# Altium schematic sheet MainSheet.SchDoc
size A4; Organization: OLTEST; Revision: 01; SheetNumber: 0; SheetTotal: 13; Название листа: Название листа; Разработчик: Бондарчук С.; Прибор: R100; АМАК.000000.000 Э3: R100.230.030.000-00; Дата: 16.04.2019; Формат: A4; WorkspaceName: R100_Board_v1
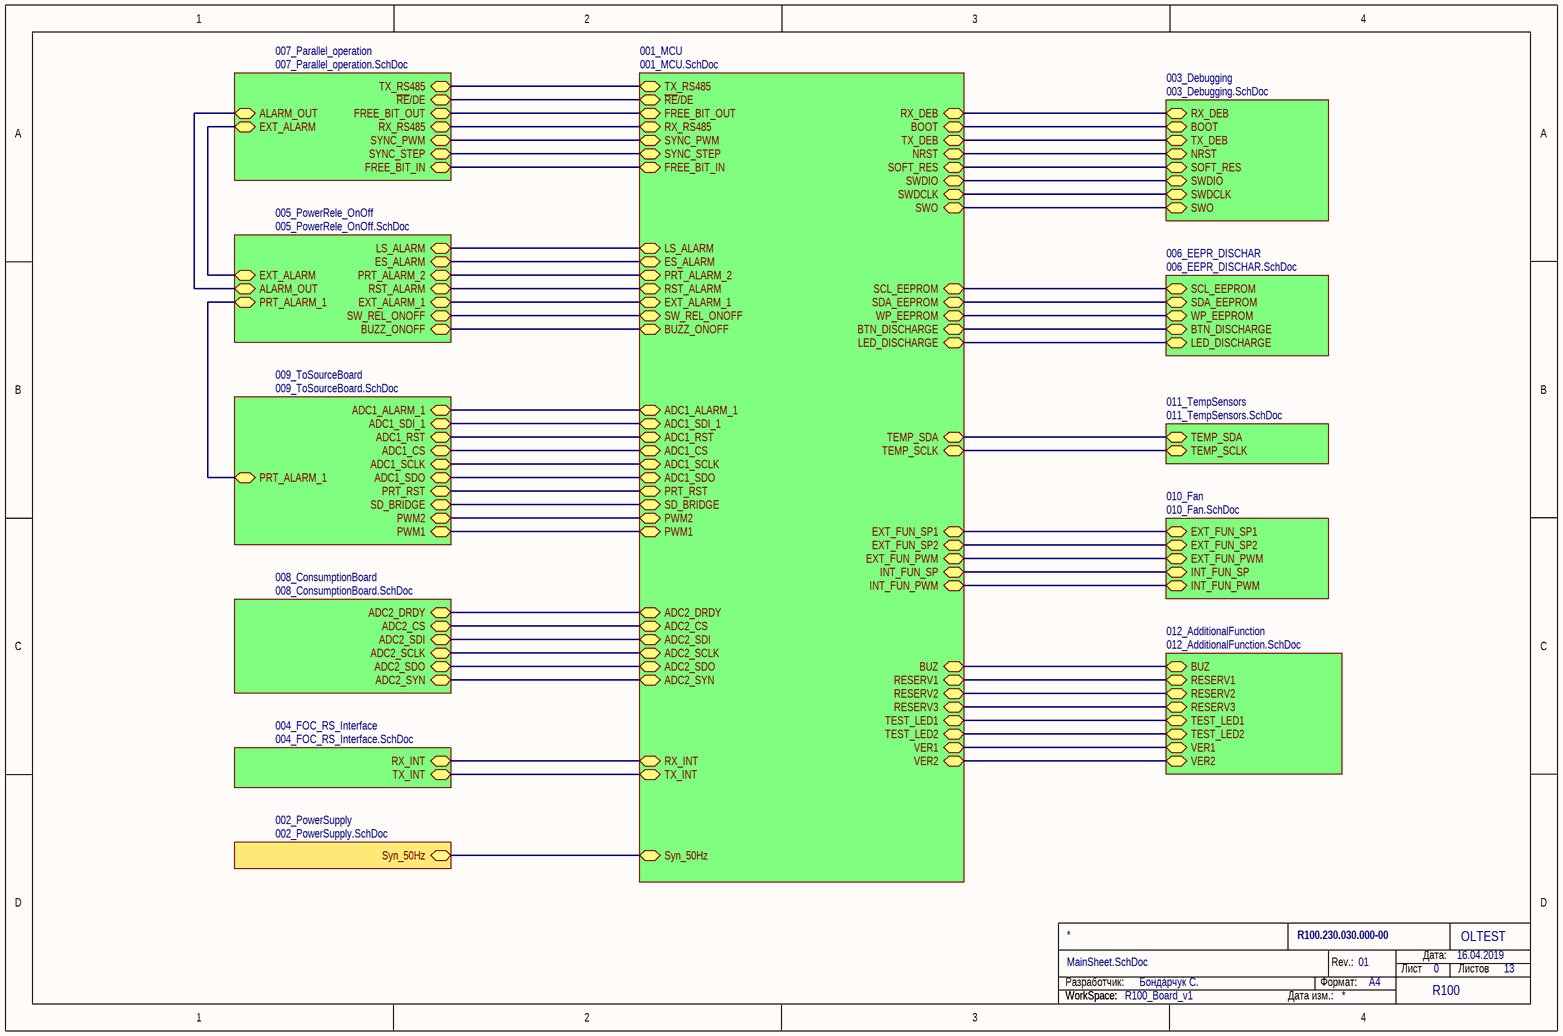
[diagram p0: MainSheet.SchDoc]

## Sub-sheets
001_MCU = 001_MCU.SchDoc: SWO, SOFT_RES, TX_INT, PRT_ALARM_2, WP_EEPROM, SWDCLK, TX_RS485, LS_ALARM, SCL_EEPROM, SW_REL_ONOFF, ES_ALARM, NRST, RST_ALARM, RX_INT, RX_DEB, Syn_50Hz, BOOT, SDA_EEPROM, SWDIO, TX_DEB, SYNC_PWM, INT_FUN_SP, ADC1_SDI_1, TEMP_SDA, VER2, LED_DISCHARGE, RX_RS485, ADC1_SDO, ADC2_SDI, EXT_FUN_SP2, ADC1_ALARM_1, FREE_BIT_IN, VER1, ADC2_CS, TEST_LED2, BUZ, ADC1_RST, ADC2_SYN, SD_BRIDGE, ADC1_SCLK, TEST_LED1, PWM1, BUZZ_ONOFF, ADC2_SCLK, EXT_FUN_SP1, ADC1_CS, BTN_DISCHARGE, RESERV2, EXT_ALARM_1, PWM2, ADC2_SDO, RESERV1, EXT_FUN_PWM, TEMP_SCLK, PRT_RST, RESERV3, FREE_BIT_OUT, ~{RE}/DE, INT_FUN_PWM, ADC2_DRDY, SYNC_STEP
002_PowerSupply = 002_PowerSupply.SchDoc: Syn_50Hz
003_Debugging = 003_Debugging.SchDoc: SWDIO, TX_DEB, RX_DEB, SWO, SWDCLK, BOOT, SOFT_RES, NRST
004_FOC_RS_Interface = 004_FOC_RS_Interface.SchDoc: RX_INT, TX_INT
005_PowerRele_OnOff = 005_PowerRele_OnOff.SchDoc: PRT_ALARM_1, LS_ALARM, ES_ALARM, PRT_ALARM_2, RST_ALARM, SW_REL_ONOFF, EXT_ALARM, ALARM_OUT, BUZZ_ONOFF, EXT_ALARM_1
006_EEPR_DISCHAR = 006_EEPR_DISCHAR.SchDoc: SCL_EEPROM, SDA_EEPROM, WP_EEPROM, BTN_DISCHARGE, LED_DISCHARGE
007_Parallel_operation = 007_Parallel_operation.SchDoc: ~{RE}/DE, FREE_BIT_OUT, TX_RS485, ALARM_OUT, RX_RS485, SYNC_PWM, SYNC_STEP, EXT_ALARM, FREE_BIT_IN
008_ConsumptionBoard = 008_ConsumptionBoard.SchDoc: ADC2_CS, ADC2_SDI, ADC2_DRDY, ADC2_SCLK, ADC2_SDO, ADC2_SYN
009_ToSourceBoard = 009_ToSourceBoard.SchDoc: SD_BRIDGE, ADC1_RST, ADC1_ALARM_1, PRT_RST, ADC1_SDI_1, PRT_ALARM_1, ADC1_SCLK, ADC1_CS, ADC1_SDO, PWM2, PWM1
010_Fan = 010_Fan.SchDoc: EXT_FUN_PWM, EXT_FUN_SP1, EXT_FUN_SP2, INT_FUN_SP, INT_FUN_PWM
011_TempSensors = 011_TempSensors.SchDoc: TEMP_SCLK, TEMP_SDA
012_AdditionalFunction = 012_AdditionalFunction.SchDoc: RESERV3, RESERV2, VER2, BUZ, RESERV1, VER1, TEST_LED1, TEST_LED2

## Nets
(unnamed): sheet 001_MCU/SWO, sheet 003_Debugging/SWO
(unnamed): sheet 001_MCU/SOFT_RES, sheet 003_Debugging/SOFT_RES
(unnamed): sheet 001_MCU/TX_INT, sheet 004_FOC_RS_Interface/TX_INT
(unnamed): sheet 001_MCU/PRT_ALARM_2, sheet 005_PowerRele_OnOff/PRT_ALARM_2
(unnamed): sheet 001_MCU/WP_EEPROM, sheet 006_EEPR_DISCHAR/WP_EEPROM
(unnamed): sheet 001_MCU/SWDCLK, sheet 003_Debugging/SWDCLK
(unnamed): sheet 001_MCU/TX_RS485, sheet 007_Parallel_operation/TX_RS485
(unnamed): sheet 001_MCU/LS_ALARM, sheet 005_PowerRele_OnOff/LS_ALARM
(unnamed): sheet 001_MCU/SCL_EEPROM, sheet 006_EEPR_DISCHAR/SCL_EEPROM
(unnamed): sheet 001_MCU/SW_REL_ONOFF, sheet 005_PowerRele_OnOff/SW_REL_ONOFF
(unnamed): sheet 001_MCU/ES_ALARM, sheet 005_PowerRele_OnOff/ES_ALARM
(unnamed): sheet 001_MCU/NRST, sheet 003_Debugging/NRST
(unnamed): sheet 001_MCU/RST_ALARM, sheet 005_PowerRele_OnOff/RST_ALARM
(unnamed): sheet 001_MCU/RX_INT, sheet 004_FOC_RS_Interface/RX_INT
(unnamed): sheet 001_MCU/RX_DEB, sheet 003_Debugging/RX_DEB
(unnamed): sheet 001_MCU/Syn_50Hz, sheet 002_PowerSupply/Syn_50Hz
(unnamed): sheet 001_MCU/BOOT, sheet 003_Debugging/BOOT
(unnamed): sheet 001_MCU/SDA_EEPROM, sheet 006_EEPR_DISCHAR/SDA_EEPROM
(unnamed): sheet 001_MCU/SWDIO, sheet 003_Debugging/SWDIO
(unnamed): sheet 001_MCU/TX_DEB, sheet 003_Debugging/TX_DEB
(unnamed): sheet 001_MCU/SYNC_PWM, sheet 007_Parallel_operation/SYNC_PWM
(unnamed): sheet 001_MCU/INT_FUN_SP, sheet 010_Fan/INT_FUN_SP
(unnamed): sheet 001_MCU/ADC1_SDI_1, sheet 009_ToSourceBoard/ADC1_SDI_1
(unnamed): sheet 001_MCU/TEMP_SDA, sheet 011_TempSensors/TEMP_SDA
(unnamed): sheet 001_MCU/VER2, sheet 012_AdditionalFunction/VER2
(unnamed): sheet 001_MCU/LED_DISCHARGE, sheet 006_EEPR_DISCHAR/LED_DISCHARGE
(unnamed): sheet 001_MCU/RX_RS485, sheet 007_Parallel_operation/RX_RS485
(unnamed): sheet 001_MCU/ADC1_SDO, sheet 009_ToSourceBoard/ADC1_SDO
(unnamed): sheet 001_MCU/ADC2_SDI, sheet 008_ConsumptionBoard/ADC2_SDI
(unnamed): sheet 001_MCU/EXT_FUN_SP2, sheet 010_Fan/EXT_FUN_SP2
(unnamed): sheet 001_MCU/ADC1_ALARM_1, sheet 009_ToSourceBoard/ADC1_ALARM_1
(unnamed): sheet 001_MCU/FREE_BIT_IN, sheet 007_Parallel_operation/FREE_BIT_IN
(unnamed): sheet 001_MCU/VER1, sheet 012_AdditionalFunction/VER1
(unnamed): sheet 001_MCU/ADC2_CS, sheet 008_ConsumptionBoard/ADC2_CS
(unnamed): sheet 001_MCU/TEST_LED2, sheet 012_AdditionalFunction/TEST_LED2
(unnamed): sheet 001_MCU/BUZ, sheet 012_AdditionalFunction/BUZ
(unnamed): sheet 001_MCU/ADC1_RST, sheet 009_ToSourceBoard/ADC1_RST
(unnamed): sheet 001_MCU/ADC2_SYN, sheet 008_ConsumptionBoard/ADC2_SYN
(unnamed): sheet 001_MCU/SD_BRIDGE, sheet 009_ToSourceBoard/SD_BRIDGE
(unnamed): sheet 001_MCU/ADC1_SCLK, sheet 009_ToSourceBoard/ADC1_SCLK
(unnamed): sheet 001_MCU/TEST_LED1, sheet 012_AdditionalFunction/TEST_LED1
(unnamed): sheet 001_MCU/PWM1, sheet 009_ToSourceBoard/PWM1
(unnamed): sheet 001_MCU/BUZZ_ONOFF, sheet 005_PowerRele_OnOff/BUZZ_ONOFF
(unnamed): sheet 001_MCU/ADC2_SCLK, sheet 008_ConsumptionBoard/ADC2_SCLK
(unnamed): sheet 001_MCU/EXT_FUN_SP1, sheet 010_Fan/EXT_FUN_SP1
(unnamed): sheet 001_MCU/ADC1_CS, sheet 009_ToSourceBoard/ADC1_CS
(unnamed): sheet 001_MCU/BTN_DISCHARGE, sheet 006_EEPR_DISCHAR/BTN_DISCHARGE
(unnamed): sheet 001_MCU/RESERV2, sheet 012_AdditionalFunction/RESERV2
(unnamed): sheet 001_MCU/EXT_ALARM_1, sheet 005_PowerRele_OnOff/EXT_ALARM_1
(unnamed): sheet 001_MCU/PWM2, sheet 009_ToSourceBoard/PWM2
(unnamed): sheet 001_MCU/ADC2_SDO, sheet 008_ConsumptionBoard/ADC2_SDO
(unnamed): sheet 001_MCU/RESERV1, sheet 012_AdditionalFunction/RESERV1
(unnamed): sheet 001_MCU/EXT_FUN_PWM, sheet 010_Fan/EXT_FUN_PWM
(unnamed): sheet 001_MCU/TEMP_SCLK, sheet 011_TempSensors/TEMP_SCLK
(unnamed): sheet 001_MCU/PRT_RST, sheet 009_ToSourceBoard/PRT_RST
(unnamed): sheet 001_MCU/RESERV3, sheet 012_AdditionalFunction/RESERV3
(unnamed): sheet 001_MCU/FREE_BIT_OUT, sheet 007_Parallel_operation/FREE_BIT_OUT
(unnamed): sheet 001_MCU/~{RE}/DE, sheet 007_Parallel_operation/~{RE}/DE
(unnamed): sheet 001_MCU/INT_FUN_PWM, sheet 010_Fan/INT_FUN_PWM
(unnamed): sheet 001_MCU/ADC2_DRDY, sheet 008_ConsumptionBoard/ADC2_DRDY
(unnamed): sheet 001_MCU/SYNC_STEP, sheet 007_Parallel_operation/SYNC_STEP
(unnamed): sheet 005_PowerRele_OnOff/PRT_ALARM_1, sheet 009_ToSourceBoard/PRT_ALARM_1
(unnamed): sheet 005_PowerRele_OnOff/EXT_ALARM, sheet 007_Parallel_operation/EXT_ALARM
(unnamed): sheet 005_PowerRele_OnOff/ALARM_OUT, sheet 007_Parallel_operation/ALARM_OUT

## Notes on the sheet
- Разработчик:
- Формат:
- Rev.:
- Лист
- Дата:
- Листов
- WorkSpace:
- Дата изм.: